# Altium schematic sheet Prosthetic_Arm_Switch.SchDoc
size A4; SheetNumber: 1; SheetTotal: 1
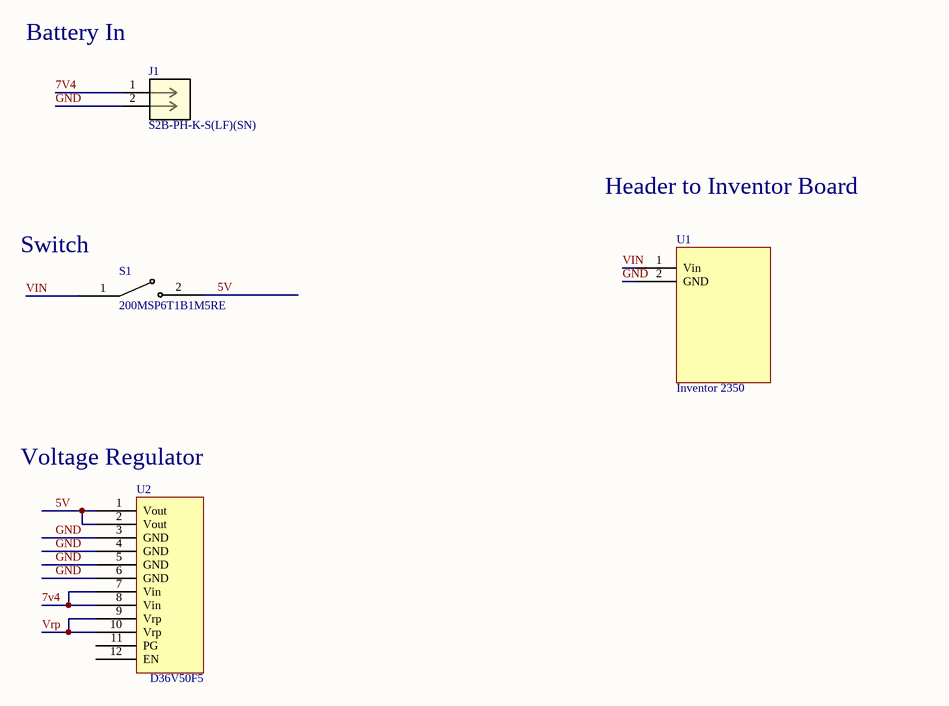
[diagram p0: Prosthetic_Arm_Switch.SchDoc]

## Parts
J1  S2B-PH-K-S(LF)(SN)  [CONN_S2B-PH-K-S_JST]
S1  200MSP6T1B1M5RE  [SWITCH]
U1  Inventor 2350  [Inventor_2350]
U2  (no value)  [D36V50F5_]

## Nets
5V: S1.2 U2.1(Vout) U2.2(Vout)
7v4: J1.1 U2.7(Vin) U2.8(Vin)
GND: J1.2 U1.2(GND) U2.3(GND) U2.4(GND) U2.5(GND) U2.6(GND)
VIN: S1.1 U1.1(Vin)
Vrp: U2.9(Vrp) U2.10(Vrp)

Not connected (* = marked no-connect by the designer): U2 11(PG) 12(EN)

## Notes on the sheet
- (near J1) Battery In
- Header to Inventor Board
- (near S1) Switch
- (near U2) Voltage Regulator

## Library data of the parts
J1 = S2B-PH-K-SLFSN: CONNECTOR; MALE; THROUGH HOLE; 2.0MM PITCH; DISCONNECTABLE CRIMP STYLE CONNECTOR; SIDE ENTRY TYPE; RIGHT ANGLE; 2PINS; Manufacturer_Name: JST; Copyright: Copyright (C) 2025 Ultra Librarian. All rights reserved.; Manufacturer_Part_Number: S2B-PH-K-S(LF)(SN); RefDes: RefDes; Type: Type
S1 = 200MSP6T1B1M5RE: SPST Switch
U2 = D36V50F5: 5V, 5.5A Step-Down Voltage Regulator D36V50F5